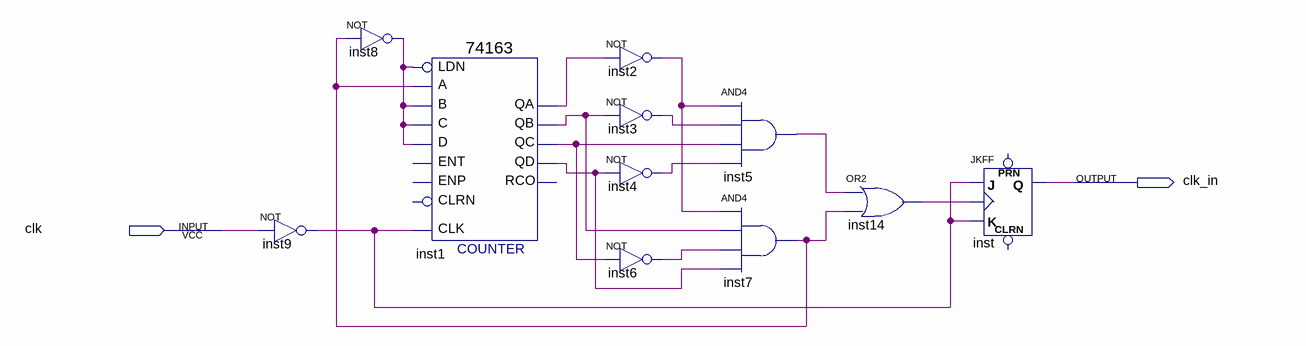
[diagram p0: schematic sheet]
// Quartus schematic Block1_principal.bdf as structural Verilog: 11 symbols, 2 pins
module Block1_principal (
  input  clk,
  output clk_in
);

  wire inst1_qa, inst1_qb, inst1_qc, inst1_qd, inst2_out, inst3_out, inst4_out, inst5_out, inst6_out,
       inst7_out, inst8_out, inst9_out, inst14_out;

  not inst9 (inst9_out, clk);
  not inst8 (inst8_out, inst7_out);
  \74163  inst1 (
    .C(inst8_out), .B(inst8_out), .A(inst7_out), .D(inst8_out), .CLK(inst9_out), .LDN(inst8_out),
    .QA(inst1_qa), .QB(inst1_qb), .QC(inst1_qc), .QD(inst1_qd));  // open: ENT, CLRN, ENP, RCO
  not inst2 (inst2_out, inst1_qa);
  not inst3 (inst3_out, inst1_qb);
  not inst4 (inst4_out, inst1_qd);
  not inst6 (inst6_out, inst1_qc);
  and inst5 (inst5_out, inst2_out, inst3_out, inst1_qc, inst4_out);
  and inst7 (inst7_out, inst2_out, inst1_qb, inst6_out, inst1_qd);
  or inst14 (inst14_out, inst5_out, inst7_out);
  JKFF inst (.K(inst9_out), .J(inst9_out), .CLK(inst14_out), .Q(clk_in));  // open: PRN, CLRN
endmodule
